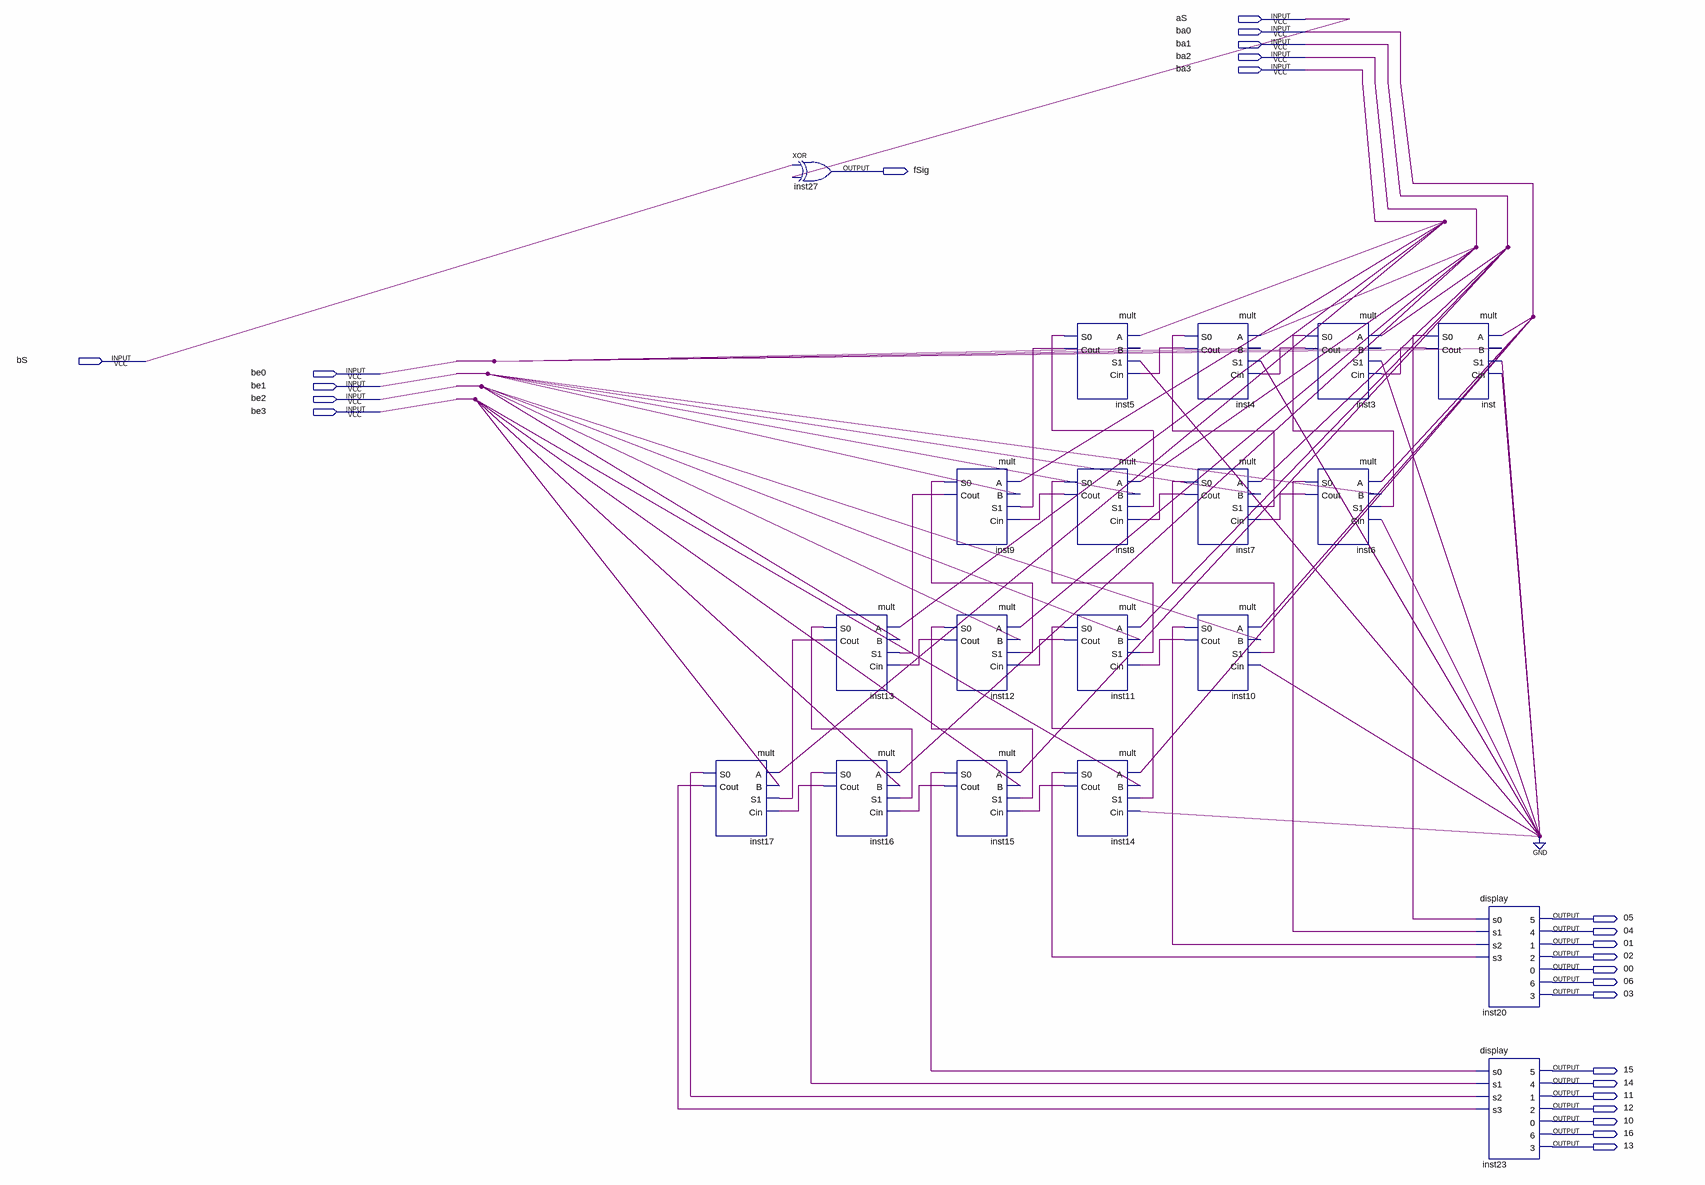
[diagram p0: schematic sheet]
// Quartus schematic multiplicadortotal.bdf as structural Verilog: 19 symbols, 25 pins
module multiplicadortotal (
  input  aS,
  input  ba0,
  input  ba1,
  input  ba2,
  input  ba3,
  input  bS,
  input  be0,
  input  be1,
  input  be2,
  input  be3,
  output fSig,
  output \05 ,
  output \04 ,
  output \01 ,
  output \02 ,
  output \00 ,
  output \06 ,
  output \03 ,
  output \15 ,
  output \14 ,
  output \11 ,
  output \12 ,
  output \10 ,
  output \16 ,
  output \13 
);

  wire inst3_cout, inst3_s0, inst4_cout, inst4_s0, inst5_cout, inst5_s0, inst6_cout, inst6_s0, inst7_cout,
       inst7_s0, inst8_cout, inst8_s0, inst9_cout, inst9_s0, inst10_cout, inst10_s0, inst11_cout, inst11_s0,
       inst12_cout, inst12_s0, inst13_cout, inst13_s0, inst14_cout, inst14_s0, inst15_cout, inst15_s0,
       inst16_cout, inst16_s0, inst17_cout, inst17_s0, inst_cout, inst_s0;

  mult inst17 (.A(ba3), .B(be3), .S1(inst13_cout), .Cin(inst16_cout), .S0(inst17_s0), .Cout(inst17_cout));
  xor inst27 (fSig, bS, aS);
  mult inst13 (.A(ba3), .B(be2), .S1(inst9_cout), .Cin(inst12_cout), .S0(inst13_s0), .Cout(inst13_cout));
  mult inst16 (.A(ba2), .B(be3), .S1(inst13_s0), .Cin(inst15_cout), .S0(inst16_s0), .Cout(inst16_cout));
  mult inst9 (.A(ba3), .B(be1), .S1(inst5_cout), .Cin(inst8_cout), .S0(inst9_s0), .Cout(inst9_cout));
  mult inst12 (.A(ba2), .B(be2), .S1(inst9_s0), .Cin(inst11_cout), .S0(inst12_s0), .Cout(inst12_cout));
  mult inst15 (.A(ba1), .B(be3), .S1(inst12_s0), .Cin(inst14_cout), .S0(inst15_s0), .Cout(inst15_cout));
  mult inst5 (.A(ba3), .B(be0), .S1(1'b0), .Cin(inst4_cout), .S0(inst5_s0), .Cout(inst5_cout));
  mult inst8 (.A(ba2), .B(be1), .S1(inst5_s0), .Cin(inst7_cout), .S0(inst8_s0), .Cout(inst8_cout));
  mult inst11 (.A(ba1), .B(be2), .S1(inst8_s0), .Cin(inst10_cout), .S0(inst11_s0), .Cout(inst11_cout));
  mult inst14 (.A(ba0), .B(be3), .S1(inst11_s0), .Cin(1'b0), .S0(inst14_s0), .Cout(inst14_cout));
  mult inst4 (.A(ba2), .B(be0), .S1(1'b0), .Cin(inst3_cout), .S0(inst4_s0), .Cout(inst4_cout));
  mult inst7 (.A(ba1), .B(be1), .S1(inst4_s0), .Cin(inst6_cout), .S0(inst7_s0), .Cout(inst7_cout));
  mult inst10 (.A(ba0), .B(be2), .S1(inst7_s0), .Cin(1'b0), .S0(inst10_s0), .Cout(inst10_cout));
  mult inst3 (.A(ba1), .B(be0), .S1(1'b0), .Cin(inst_cout), .S0(inst3_s0), .Cout(inst3_cout));
  mult inst6 (.A(ba0), .B(be1), .S1(inst3_s0), .Cin(1'b0), .S0(inst6_s0), .Cout(inst6_cout));
  mult inst (.A(ba0), .B(be0), .S1(1'b0), .Cin(1'b0), .S0(inst_s0), .Cout(inst_cout));
  display inst20 (
    .s0(inst_s0), .s1(inst6_s0), .s2(inst10_s0), .s3(inst14_s0), .\5 (\05 ), .\4 (\04 ), .\1 (\01 ),
    .\2 (\02 ), .\0 (\00 ), .\6 (\06 ), .\3 (\03 ));
  display inst23 (
    .s0(inst15_s0), .s1(inst16_s0), .s2(inst17_s0), .s3(inst17_cout), .\5 (\15 ), .\4 (\14 ), .\1 (\11 ),
    .\2 (\12 ), .\0 (\10 ), .\6 (\16 ), .\3 (\13 ));
endmodule
